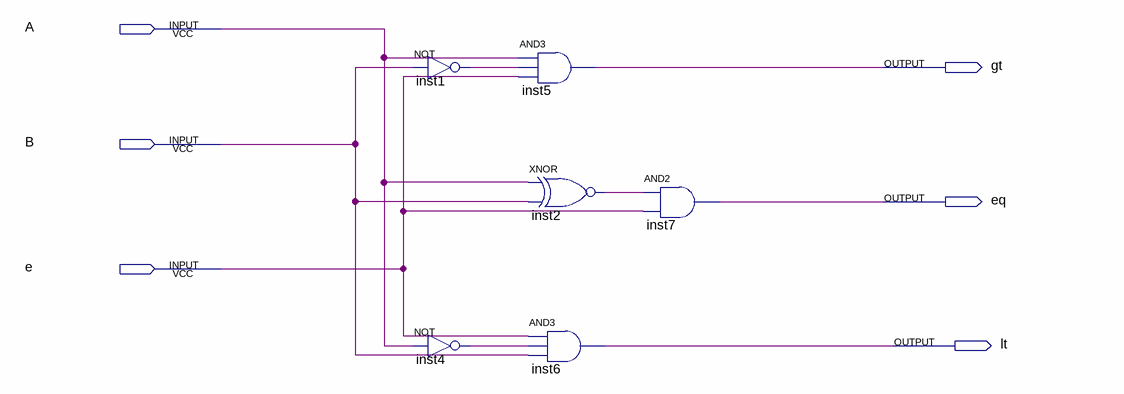
[diagram p0: schematic sheet]
// Quartus schematic comparision1bit - Copy.bdf as structural Verilog: 6 symbols, 6 pins
module \comparision1bit_-_Copy  (
  input  A,
  input  B,
  input  e,
  output gt,
  output eq,
  output lt
);

  wire inst1_out, inst2_out, inst4_out;

  not inst1 (inst1_out, B);
  not inst4 (inst4_out, A);
  and inst5 (gt, A, inst1_out, e);
  xnor inst2 (inst2_out, A, B);
  and inst6 (lt, e, inst4_out, B);
  and inst7 (eq, inst2_out, e);
endmodule
